# Altium schematic sheet charging_booster.SchDoc
size A2
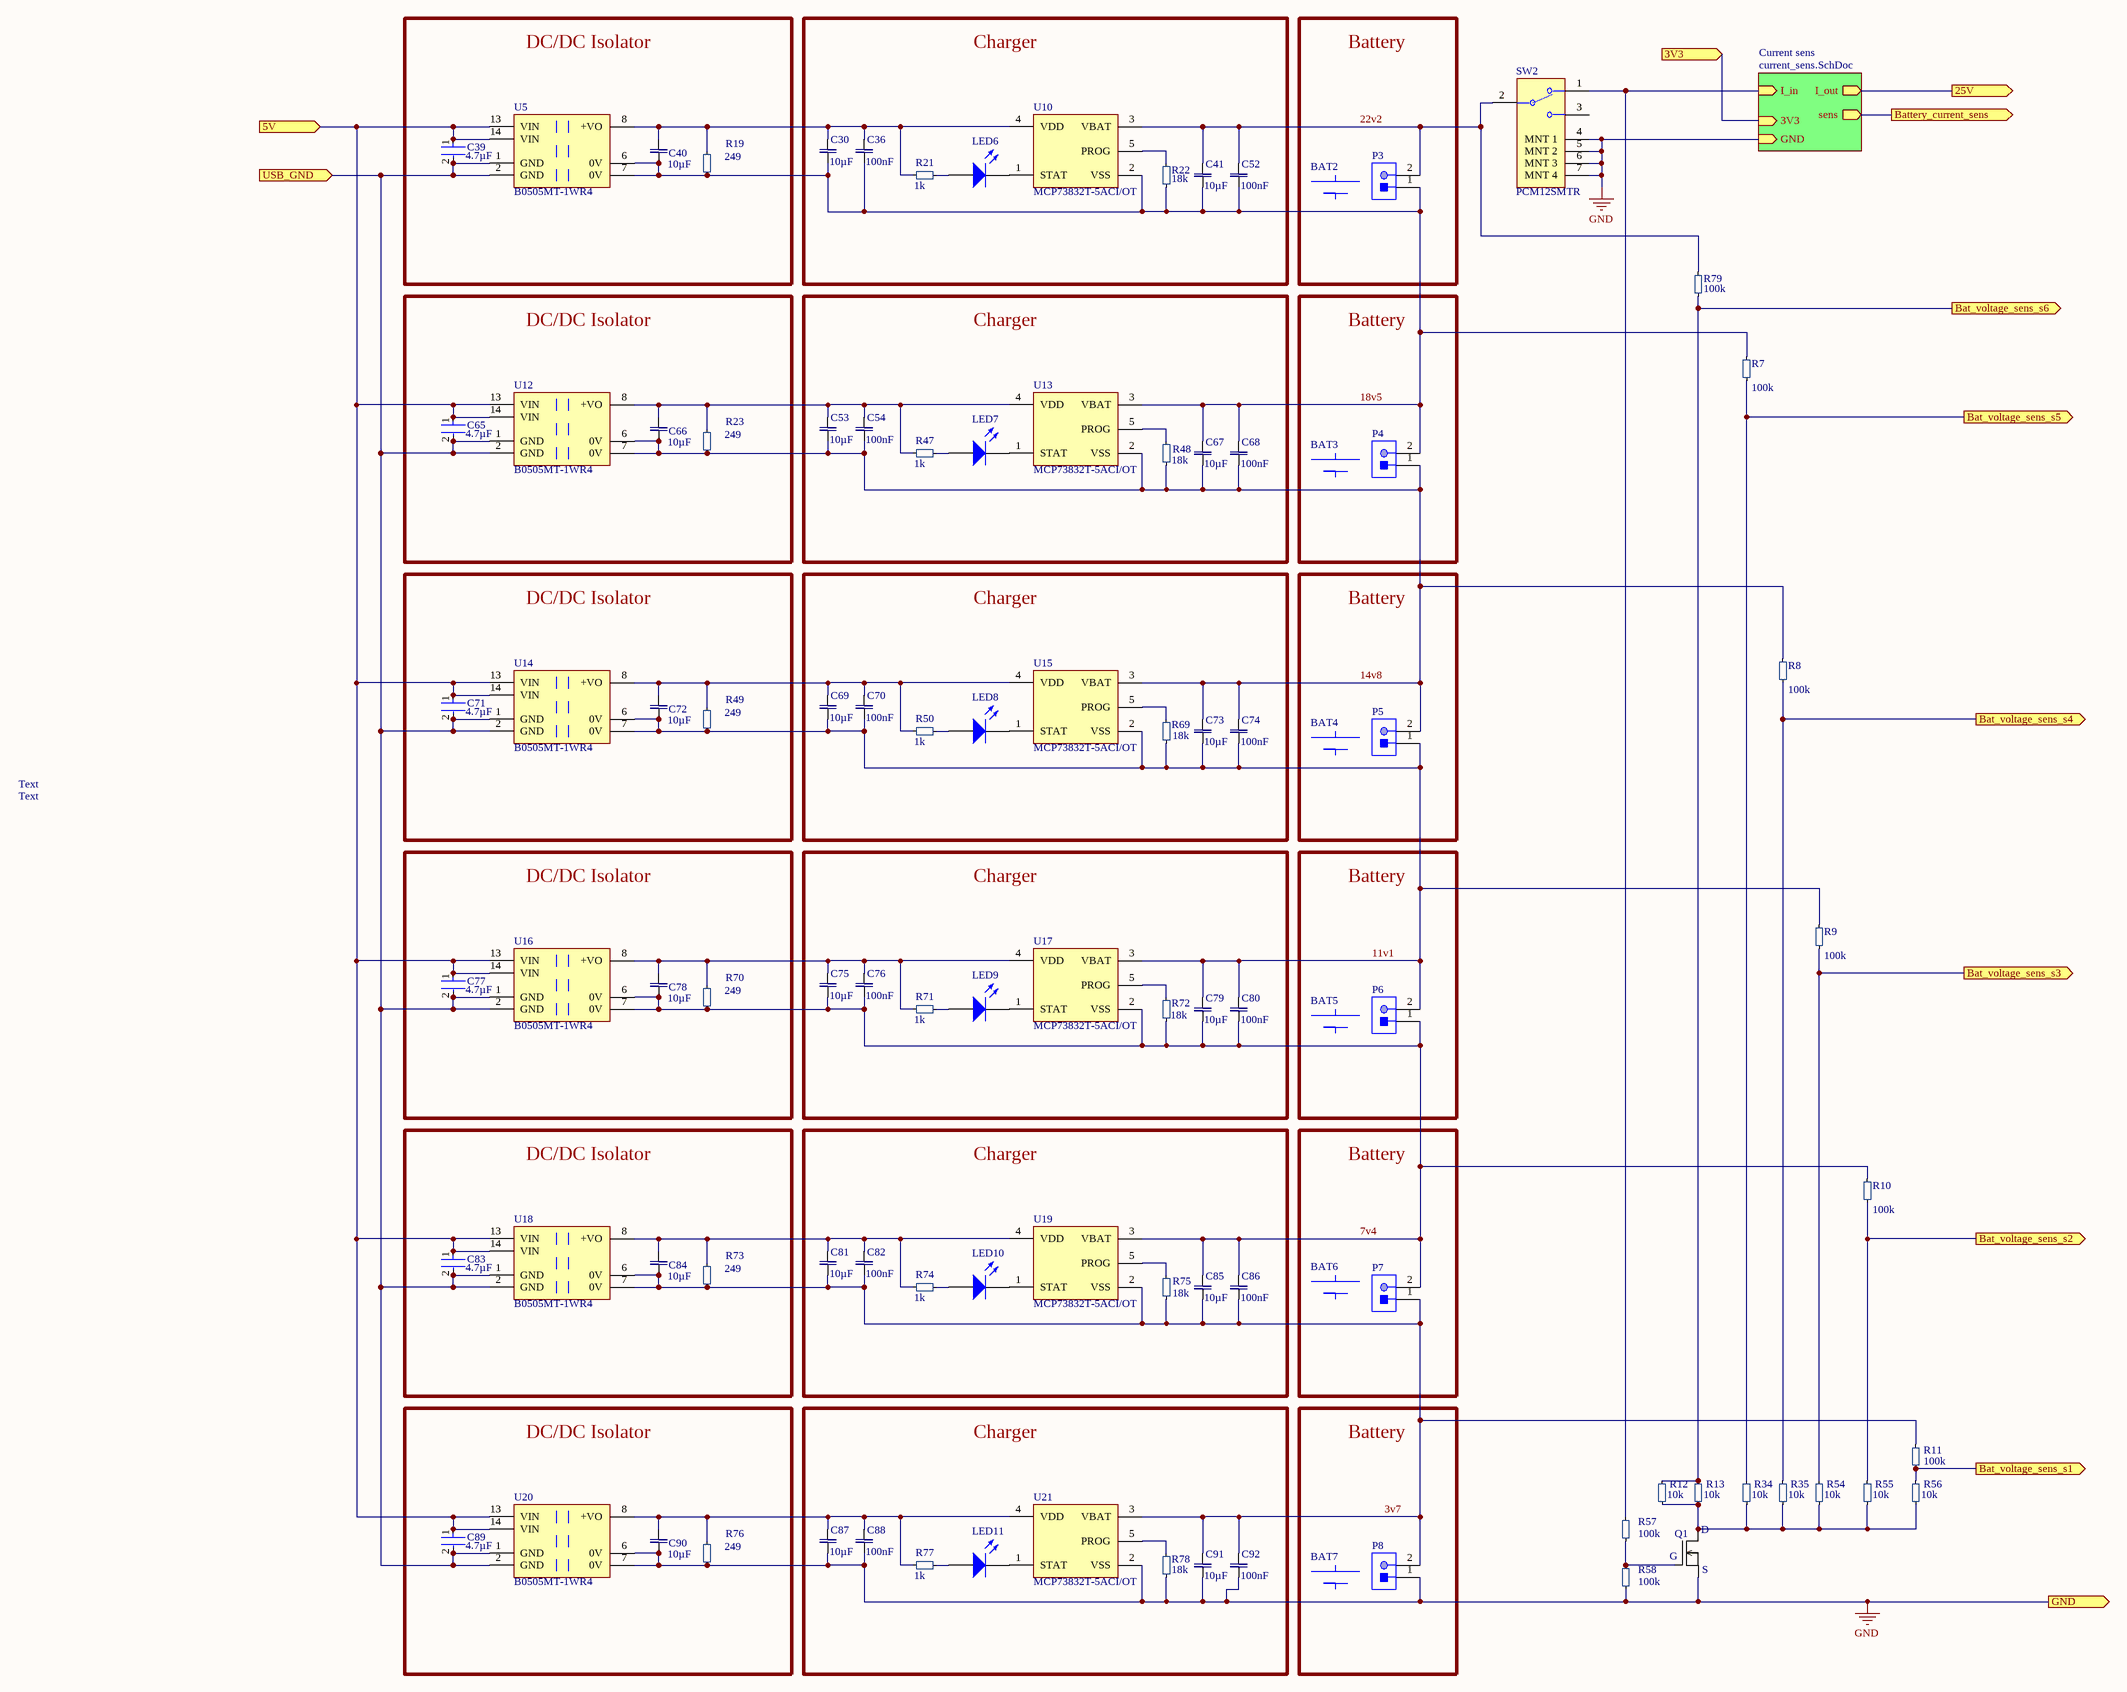
[diagram p0: charging_booster.SchDoc]

## Parts
BAT2  702035_380mAH_20C_ebay  (value not drawn)  (mechanical)
BAT3  702035_380mAH_20C_ebay  (value not drawn)  (mechanical)
BAT4  702035_380mAH_20C_ebay  (value not drawn)  (mechanical)
BAT5  702035_380mAH_20C_ebay  (value not drawn)  (mechanical)
BAT6  702035_380mAH_20C_ebay  (value not drawn)  (mechanical)
BAT7  702035_380mAH_20C_ebay  (value not drawn)  (mechanical)
C30  Capacitance: 10µF  [Chip2PinSM127P600-8N]  (hidden comment: CL31A106MBHNNNE)
C36  Capacitance: 100nF  [cap0402]  (hidden comment: GRM155R71H104ME14D)
C39  Capacitance: 4.7µF  [FP-CL21-IPC_A]  (hidden comment: CL21A475KAQNNNE)
C40  Capacitance: 10µF  [Chip2PinSM127P600-8N]  (hidden comment: CL31A106MBHNNNE)
C41  Capacitance: 10µF  [Chip2PinSM127P600-8N]  (hidden comment: CL31A106MBHNNNE)
C52  Capacitance: 100nF  [cap0402]  (hidden comment: GRM155R71H104ME14D)
C53  Capacitance: 10µF  [Chip2PinSM127P600-8N]  (hidden comment: CL31A106MBHNNNE)
C54  Capacitance: 100nF  [cap0402]  (hidden comment: GRM155R71H104ME14D)
C65  Capacitance: 4.7µF  [FP-CL21-IPC_A]  (hidden comment: CL21A475KAQNNNE)
C66  Capacitance: 10µF  [Chip2PinSM127P600-8N]  (hidden comment: CL31A106MBHNNNE)
C67  Capacitance: 10µF  [Chip2PinSM127P600-8N]  (hidden comment: CL31A106MBHNNNE)
C68  Capacitance: 100nF  [cap0402]  (hidden comment: GRM155R71H104ME14D)
C69  Capacitance: 10µF  [Chip2PinSM127P600-8N]  (hidden comment: CL31A106MBHNNNE)
C70  Capacitance: 100nF  [cap0402]  (hidden comment: GRM155R71H104ME14D)
C71  Capacitance: 4.7µF  [FP-CL21-IPC_A]  (hidden comment: CL21A475KAQNNNE)
C72  Capacitance: 10µF  [Chip2PinSM127P600-8N]  (hidden comment: CL31A106MBHNNNE)
C73  Capacitance: 10µF  [Chip2PinSM127P600-8N]  (hidden comment: CL31A106MBHNNNE)
C74  Capacitance: 100nF  [cap0402]  (hidden comment: GRM155R71H104ME14D)
C75  Capacitance: 10µF  [Chip2PinSM127P600-8N]  (hidden comment: CL31A106MBHNNNE)
C76  Capacitance: 100nF  [cap0402]  (hidden comment: GRM155R71H104ME14D)
C77  Capacitance: 4.7µF  [FP-CL21-IPC_A]  (hidden comment: CL21A475KAQNNNE)
C78  Capacitance: 10µF  [Chip2PinSM127P600-8N]  (hidden comment: CL31A106MBHNNNE)
C79  Capacitance: 10µF  [Chip2PinSM127P600-8N]  (hidden comment: CL31A106MBHNNNE)
C80  Capacitance: 100nF  [cap0402]  (hidden comment: GRM155R71H104ME14D)
C81  Capacitance: 10µF  [Chip2PinSM127P600-8N]  (hidden comment: CL31A106MBHNNNE)
C82  Capacitance: 100nF  [cap0402]  (hidden comment: GRM155R71H104ME14D)
C83  Capacitance: 4.7µF  [FP-CL21-IPC_A]  (hidden comment: CL21A475KAQNNNE)
C84  Capacitance: 10µF  [Chip2PinSM127P600-8N]  (hidden comment: CL31A106MBHNNNE)
C85  Capacitance: 10µF  [Chip2PinSM127P600-8N]  (hidden comment: CL31A106MBHNNNE)
C86  Capacitance: 100nF  [cap0402]  (hidden comment: GRM155R71H104ME14D)
C87  Capacitance: 10µF  [Chip2PinSM127P600-8N]  (hidden comment: CL31A106MBHNNNE)
C88  Capacitance: 100nF  [cap0402]  (hidden comment: GRM155R71H104ME14D)
C89  Capacitance: 4.7µF  [FP-CL21-IPC_A]  (hidden comment: CL21A475KAQNNNE)
C90  Capacitance: 10µF  [Chip2PinSM127P600-8N]  (hidden comment: CL31A106MBHNNNE)
C91  Capacitance: 10µF  [Chip2PinSM127P600-8N]  (hidden comment: CL31A106MBHNNNE)
C92  Capacitance: 100nF  [cap0402]  (hidden comment: GRM155R71H104ME14D)
LED6  150080BS75000  [0805_A]  (value not drawn)
LED7  150080BS75000  [0805_A]  (value not drawn)
LED8  150080BS75000  [0805_A]  (value not drawn)
LED9  150080BS75000  [0805_A]  (value not drawn)
LED10  150080BS75000  [0805_A]  (value not drawn)
LED11  150080BS75000  [0805_A]  (value not drawn)
P3  S2B-XH-A(LF)(SN)  [JST-S2B-XH-A(LF)(SN)_V]  (value not drawn)
P4  S2B-XH-A(LF)(SN)  [JST-S2B-XH-A(LF)(SN)_V]  (value not drawn)
P5  S2B-XH-A(LF)(SN)  [JST-S2B-XH-A(LF)(SN)_V]  (value not drawn)
P6  S2B-XH-A(LF)(SN)  [JST-S2B-XH-A(LF)(SN)_V]  (value not drawn)
P7  S2B-XH-A(LF)(SN)  [JST-S2B-XH-A(LF)(SN)_V]  (value not drawn)
P8  S2B-XH-A(LF)(SN)  [JST-S2B-XH-A(LF)(SN)_V]  (value not drawn)
Q1  SSM3K7002CFU,LF  [SSM3K7002CFU,LF-Footprint-1]  (value not drawn)
R7  Resistance: 100k  [SMD_0402(1005)_M]  (hidden comment: RC0402FR-07100KL)
R8  Resistance: 100k  [SMD_0402(1005)_M]  (hidden comment: RC0402FR-07100KL)
R9  Resistance: 100k  [SMD_0402(1005)_M]  (hidden comment: RC0402FR-07100KL)
R10  Resistance: 100k  [SMD_0402(1005)_M]  (hidden comment: RC0402FR-07100KL)
R11  Resistance: 100k  [SMD_0402(1005)_M]  (hidden comment: RC0402FR-07100KL)
R12  Resistance: 10k  [SMD_0402(1005)_M]  (hidden comment: RC0402FR-0710KL)
R13  Resistance: 10k  [SMD_0402(1005)_M]  (hidden comment: RC0402FR-0710KL)
R19  Resistance: 249  [SMD_0402(1005)_M]  (hidden comment: RC0402FR-07249RL)
R21  Resistance: 1k  [SMD_0402(1005)_M]  (hidden comment: RC0402FR-071KL)
R22  Resistance: 18k  [RESC1005X40X25NL05T10]  (hidden comment: RC0402FR0718K)
R23  Resistance: 249  [SMD_0402(1005)_M]  (hidden comment: RC0402FR-07249RL)
R34  Resistance: 10k  [SMD_0402(1005)_M]  (hidden comment: RC0402FR-0710KL)
R35  Resistance: 10k  [SMD_0402(1005)_M]  (hidden comment: RC0402FR-0710KL)
R47  Resistance: 1k  [SMD_0402(1005)_M]  (hidden comment: RC0402FR-071KL)
R48  Resistance: 18k  [RESC1005X40X25NL05T10]  (hidden comment: RC0402FR0718K)
R49  Resistance: 249  [SMD_0402(1005)_M]  (hidden comment: RC0402FR-07249RL)
R50  Resistance: 1k  [SMD_0402(1005)_M]  (hidden comment: RC0402FR-071KL)
R54  Resistance: 10k  [SMD_0402(1005)_M]  (hidden comment: RC0402FR-0710KL)
R55  Resistance: 10k  [SMD_0402(1005)_M]  (hidden comment: RC0402FR-0710KL)
R56  Resistance: 10k  [SMD_0402(1005)_M]  (hidden comment: RC0402FR-0710KL)
R57  Resistance: 100k  [SMD_0402(1005)_M]  (hidden comment: RC0402FR-07100KL)
R58  Resistance: 100k  [SMD_0402(1005)_M]  (hidden comment: RC0402FR-07100KL)
R69  Resistance: 18k  [RESC1005X40X25NL05T10]  (hidden comment: RC0402FR0718K)
R70  Resistance: 249  [SMD_0402(1005)_M]  (hidden comment: RC0402FR-07249RL)
R71  Resistance: 1k  [SMD_0402(1005)_M]  (hidden comment: RC0402FR-071KL)
R72  Resistance: 18k  [RESC1005X40X25NL05T10]  (hidden comment: RC0402FR0718K)
R73  Resistance: 249  [SMD_0402(1005)_M]  (hidden comment: RC0402FR-07249RL)
R74  Resistance: 1k  [SMD_0402(1005)_M]  (hidden comment: RC0402FR-071KL)
R75  Resistance: 18k  [RESC1005X40X25NL05T10]  (hidden comment: RC0402FR0718K)
R76  Resistance: 249  [SMD_0402(1005)_M]  (hidden comment: RC0402FR-07249RL)
R77  Resistance: 1k  [SMD_0402(1005)_M]  (hidden comment: RC0402FR-071KL)
R78  Resistance: 18k  [RESC1005X40X25NL05T10]  (hidden comment: RC0402FR0718K)
R79  Resistance: 100k  [SMD_0402(1005)_M]  (hidden comment: RC0402FR-07100KL)
SW2  PCM12SMTR  [FP-PCM12SMTR-MFG]
U5  B0505MT-1WR4  [FP-B0505MT-1WR4-MFG]
U10  MCP73832T-5ACI/OT  [SOT-23-OT5_M]
U12  B0505MT-1WR4  [FP-B0505MT-1WR4-MFG]
U13  MCP73832T-5ACI/OT  [SOT-23-OT5_M]
U14  B0505MT-1WR4  [FP-B0505MT-1WR4-MFG]
U15  MCP73832T-5ACI/OT  [SOT-23-OT5_M]
U16  B0505MT-1WR4  [FP-B0505MT-1WR4-MFG]
U17  MCP73832T-5ACI/OT  [SOT-23-OT5_M]
U18  B0505MT-1WR4  [FP-B0505MT-1WR4-MFG]
U19  MCP73832T-5ACI/OT  [SOT-23-OT5_M]
U20  B0505MT-1WR4  [FP-B0505MT-1WR4-MFG]
U21  MCP73832T-5ACI/OT  [SOT-23-OT5_M]

## Blocks framed on the sheet
DC/DC Isolator: C39 C40 R19 U5
Charger: C30 C36 C41 C52 LED6 R21 R22 U10
Battery: BAT2 P3
DC/DC Isolator: C65 C66 R23 U12
Charger: C53 C54 C67 C68 LED7 R47 R48 U13
Battery: BAT3 P4
DC/DC Isolator: C71 C72 R49 U14
Charger: C69 C70 C73 C74 LED8 R50 R69 U15
Battery: BAT4 P5
DC/DC Isolator: C77 C78 R70 U16
Charger: C75 C76 C79 C80 LED9 R71 R72 U17
Battery: BAT5 P6
DC/DC Isolator: C83 C84 R73 U18
Charger: C81 C82 C85 C86 LED10 R74 R75 U19
Battery: BAT6 P7
DC/DC Isolator: C89 C90 R76 U20
Charger: C87 C88 C91 C92 LED11 R77 R78 U21
Battery: BAT7 P8

## Sub-sheets
Current sens = current_sens.SchDoc: sens (out), I_in (in), I_out (out), GND (in), 3V3 (in)

## Ports
3V3 (in), 5V (in), 25V (out), Bat_voltage_sens_s1 (out), Bat_voltage_sens_s2 (out), Bat_voltage_sens_s3 (out), Bat_voltage_sens_s4 (out), Bat_voltage_sens_s5 (out), Bat_voltage_sens_s6 (out), Battery_current_sens (out), GND (out), USB_GND (in)

## Nets
GND: C87.1 C88.1 C90.1 C91.1 C92.1 P8.1 Q1.2(D) R58.1 R76.1 R78.1 SW2.4(MNT_1) SW2.5(MNT_2) SW2.6(MNT_3) SW2.7(MNT_4) U20.6(0V) U20.7(0V) U21.2(VSS) ; port GND, sheet Current sens/GND
3V3: port 3V3, sheet Current sens/3V3
3v7: C81.1 C82.1 C84.1 C85.1 C86.1 C91.2 C92.2 P7.1 P8.2 R11.2 R73.1 R75.1 U18.6(0V) U18.7(0V) U19.2(VSS) U21.3(VBAT)
5V: C39.1 C65.1 C71.1 C77.1 C83.1 C89.1 U5.13(VIN) U5.14(VIN) U12.13(VIN) U12.14(VIN) U14.13(VIN) U14.14(VIN) U16.13(VIN) U16.14(VIN) U18.13(VIN) U18.14(VIN) U20.13(VIN) U20.14(VIN) ; port 5V
7v4: C75.1 C76.1 C78.1 C79.1 C80.1 C85.2 C86.2 P6.1 P7.2 R10.2 R70.1 R72.1 U16.6(0V) U16.7(0V) U17.2(VSS) U19.3(VBAT)
11v1: C69.1 C70.1 C72.1 C73.1 C74.1 C79.2 C80.2 P5.1 P6.2 R9.2 R49.1 R69.1 U14.6(0V) U14.7(0V) U15.2(VSS) U17.3(VBAT)
14v8: C53.1 C54.1 C66.1 C67.1 C68.1 C73.2 C74.2 P4.1 P5.2 R8.2 R23.1 R48.1 U12.6(0V) U12.7(0V) U13.2(VSS) U15.3(VBAT)
18v5: C30.1 C36.1 C40.1 C41.1 C52.1 C67.2 C68.2 P3.1 P4.2 R7.2 R19.1 R22.1 U5.6(0V) U5.7(0V) U10.2(VSS) U13.3(VBAT)
22v2: C41.2 C52.2 P3.2 R79.2 SW2.2 U10.3(VBAT)
25V: port 25V, sheet Current sens/I_out
Bat_voltage_sens_s1: R11.1 R56.2 ; port Bat_voltage_sens_s1
Bat_voltage_sens_s2: R10.1 R55.2 ; port Bat_voltage_sens_s2
Bat_voltage_sens_s3: R9.1 R54.2 ; port Bat_voltage_sens_s3
Bat_voltage_sens_s4: R8.1 R35.2 ; port Bat_voltage_sens_s4
Bat_voltage_sens_s5: R7.1 R34.2 ; port Bat_voltage_sens_s5
Bat_voltage_sens_s6: R12.2 R13.2 R79.1 ; port Bat_voltage_sens_s6
Battery_current_sens: port Battery_current_sens, sheet Current sens/sens
USB_GND: C39.2 C65.2 C71.2 C77.2 C83.2 C89.2 U5.1(GND) U5.2(GND) U12.1(GND) U12.2(GND) U14.1(GND) U14.2(GND) U16.1(GND) U16.2(GND) U18.1(GND) U18.2(GND) U20.1(GND) U20.2(GND) ; port USB_GND
NetC30_2: C30.2 C36.2 C40.2 R19.2 R21.2 U5.8(+VO) U10.4(VDD)
NetC53_2: C53.2 C54.2 C66.2 R23.2 R47.2 U12.8(+VO) U13.4(VDD)
NetC69_2: C69.2 C70.2 C72.2 R49.2 R50.2 U14.8(+VO) U15.4(VDD)
NetC75_2: C75.2 C76.2 C78.2 R70.2 R71.2 U16.8(+VO) U17.4(VDD)
NetC81_2: C81.2 C82.2 C84.2 R73.2 R74.2 U18.8(+VO) U19.4(VDD)
NetC87_2: C87.2 C88.2 C90.2 R76.2 R77.2 U20.8(+VO) U21.4(VDD)
NetLED6_1: LED6.1(K) U10.1(STAT)
NetLED6_2: LED6.2(A) R21.1
NetLED7_1: LED7.1(K) U13.1(STAT)
NetLED7_2: LED7.2(A) R47.1
NetLED8_1: LED8.1(K) U15.1(STAT)
NetLED8_2: LED8.2(A) R50.1
NetLED9_1: LED9.1(K) U17.1(STAT)
NetLED9_2: LED9.2(A) R71.1
NetLED10_1: LED10.1(K) U19.1(STAT)
NetLED10_2: LED10.2(A) R74.1
NetLED11_1: LED11.1(K) U21.1(STAT)
NetLED11_2: LED11.2(A) R77.1
NetQ1_1: Q1.1(G) R57.1 R58.2
NetQ1_3: Q1.3(S) R12.1 R13.1 R34.1 R35.1 R54.1 R55.1 R56.1
NetR22_2: R22.2 U10.5(PROG)
NetR48_2: R48.2 U13.5(PROG)
NetR57_2: R57.2 SW2.1 ; sheet Current sens/I_in
NetR69_2: R69.2 U15.5(PROG)
NetR72_2: R72.2 U17.5(PROG)
NetR75_2: R75.2 U19.5(PROG)
NetR78_2: R78.2 U21.5(PROG)

Not connected (* = marked no-connect by the designer): SW2 3

## Notes on the sheet
- Text

## Library data of the parts
BAT2-BAT7 = CMP-ROOT-0003-1: https://www.ebay.com/itm/122071978357; Voltage: 3.7V; Capacity: 380mAh; Mount: connector; RoHS: Yes; ComponentLink1URL: https://www.ebay.com/itm/122071978357?hash=item1c6c0e9175:g:xIQAAOSwTuJYpQfy; ComponentLink1Description: EBAY; Type: li-po; Case/Package: 702035
C30 C40 C41 C53 C66 C67 C69 C72 C73 C75 C78 C79 C81 C84 C85 C87 C90 C91 = CMP-0001-00015-3: CAP CER 10UF 50V X5R 1206; Capacitor Type: Ceramic; Tolerance: 20%; Thickness: 0.071inch; Mount: Surface Mount; Dielectric: X5R; Length: 0.126inch; Case/Package: 1206; Width: 0.063inch; Voltage Rating (DC): 50V; Max Operating Temperature: 85°C; Case Code (Imperial): 1206; Voltage Rating: 50V; Min Operating Temperature: -55°C; Packaging: Tape and Reel; Case Code (Metric): 3216; RoHS: Yes
C36 C52 C54 C68 C70 C74 C76 C80 C82 C86 C88 C92 = CMP-0001-00001-9: 0402 0.1 uF 50 V ±20% Tolerance X7R SMT Monolithic Ceramic Chip Capacitor; Value: 100nF; Voltage Rating: 50V; Length: 0.039inch; Packaging: Cut Tape; Max Operating Temperature: 125°C; Min Operating Temperature: -55°C; Mount: Surface Mount; Case/Package: 0402; Tolerance: 20%; Width: 0.02inch; Capacitor Type: Ceramic; Thickness: 0.022inch; Pins: 2; RoHS: Yes
C39 C65 C71 C77 C83 C89 = CMP-0001-00018-1: SAMSUNG ELECTRO-MECHANICS - CL21A475KAQNNNE - SMD Multilayer Ceramic Capacitor, 4.7 µF, 25 V, 0805 [2012 Metric], ± 10%, X5R, CL Series; Voltage Rating: 25V; Case/Package: 0805; Dielectric: X5R; Package Quantity: 1; Width: 0.049inch; Length: 2mm; Tolerance: 10%; Capacitor Type: Ceramic; Depth: 1.25mm; Case Code (Imperial): 0805; RoHS: Yes; Height: 1.25mm; Mount: Surface Mount; Thickness: 0.055inch; Packaging: Tape and Reel; Max Operating Temperature: 85°C; Case Code (Metric): 2012; Lead Free: Lead Free; Min Operating Temperature: -55°C; Voltage Rating (DC): 25V; Radiation Hardening: No
LED6-LED11 = CMP-00002-1: SMD LED blue 3.5 V 0805, 150080BS75000, Würth Elektronik; Dominant Wavelength: 470nm; Luminous Intensity: 145mcd; Lens Style: Clear,Rectangular; Forward Current: 30mA; Test Current: 20mA; Forward Voltage: 3.2V; Viewing Angle: 140°; Length: 2mm; Width: 1.25mm; RoHS: Yes; Height: 0.7mm; Color: Blue; Packaging: Tape and Reel; REACH SVHC: Unknown; Max Operating Temperature: 85°C; Case Code (Imperial): 0805; Lead Free: Lead Free; Case Code (Metric): 2012; Case/Package: 0805; Min Operating Temperature: -40°C; Wavelength: 470nm; Package Quantity: 4000; Mount: Surface Mount
P3-P8 = CMP-ROOT-00028-1: XH Series 2.5mm 2 Position Through Hole Shrouded Header Connector; Number of Positions: 2; RoHS: Yes; System: Connector; Mount: Through Hole
Q1 = CMP-ROOT-00035-2: Trans MOSFET N-CH Si 60V 0.17A 3-Pin USM T/R; Max Power Dissipation: 150mW; Continuous Drain Current (ID): 170mA; Input Capacitance: 17pF; Rds On Max: 3.0ohm; Case/Package: SMD/SMT; Drain to Source Voltage (Vdss): 60V; RoHS: Yes; Max Operating Temperature: 150°C; Mount: Surface Mount; Min Operating Temperature: -55°C; Packaging: Tape and Reel
R7-R11 R57 R58 R79 = CMP-0001-00006-5: Res General Purpose Thick Film 0402 100K Ohm 1% 1/16W ±100ppm/°C Molded SMD Paper T/R; Max Power Dissipation: 63mW; Voltage Rating: 50V; Value: 100k; Termination: SMD/SMT; Tolerance: 1%; Length: 0.039inch; REACH SVHC: No SVHC; Features: Moisture Resistant; Mount: SMD; Power Rating: 63mW; Depth: 0.5mm; Max Operating Temperature: 155°C; Width: 0.02inch; Height: 0.016inch; Case Code (Metric): 1005; Temperature Coefficient: 100ppm/°C; Military Standard: Not; Case/Package: 0402; Lead Free: Lead Free; Working Voltage: 50V; Package Quantity: 1; Number of Terminations: 2; Min Operating Temperature: -55°C; Composition: Thick Film; RoHS: Yes; Packaging: Tape and Reel; Case Code (Imperial): 0402
R12 R13 R34 R35 R54-R56 = CMP-008-0005-10: Surface Mount Thick Film Resistor, Rc Series, 10 Kohm, 62.5 Mw, - 1%, 50 V, 0402 [1005 Metric]; Voltage Rating: 50V; Power Rating: 62.5mW; Value: 10k; Temperature Coefficient: 100ppm/°C; Case/Package: 0402; Lead Pitch: 0.2mm; Tolerance: 1%; Composition: Thick Film; Voltage Rating (DC): 50V; Case Code (Metric): 1005; Width: 0.5mm; Lead Free: Lead Free; Number of Terminations: 2; Number of Pins: 2; Mount: SMD; Termination: SMD/SMT; Military Standard: Not; REACH SVHC: No SVHC; Length: 1mm; Depth: 0.5mm; Working Voltage: 50V; Packaging: Tape and Reel; Case Code (Imperial): 0402; Max Operating Temperature: 155°C; Height: 0.32mm; RoHS: Yes; Min Operating Temperature: -55°C
R19 R23 R49 R70 R73 R76 = CMP-0001-00022-3: Res Thick Film 0402 249 Ohm 1% 1/16W ±100ppm/°C Molded SMD Paper T/R; Capacitor Type: Ceramic; Mount: SMD; Case/Package: 0402; RoHS: Yes; Tolerance: 1%
R21 R47 R50 R71 R74 R77 = CMP-001-0000-8: Surface Mount Chip Resistor, Thick Film, RC Series, 1 kohm, 62.5 mW, 1%, 50 V, 0402 [1005 Metric]; Temperature Coefficient: 100ppm/°C; Value: 1k; Voltage Rating: 50V; Power Rating: 62.5mW; RoHS: Yes; Max Operating Temperature: 155°C; Width: 0.5mm; Case Code (Metric): 1005; Mount: SMD; Min Operating Temperature: -55°C; Lead Free: Lead Free; Military Standard: Not; Case Code (Imperial): 0402; Number of Pins: 2; Height: 0.32mm; Case/Package: 0402; Composition: Thick Film; Packaging: Tape and Reel; Length: 1mm; Tolerance: 1%; Depth: 0.5mm; Voltage Rating (DC): 50V; Termination: SMD/SMT; REACH SVHC: Unknown
R22 R48 R69 R72 R75 R78 = CMP-001-0023-4: RES SMD 18K OHM 1% 1/16W 0402; Temperature Coefficient: 100ppm/°C; Voltage Rating: 50V; Power Rating: 62.5mW; RoHS: Yes; Max Operating Temperature: 155°C; Width: 0.02inch; Case Code (Metric): 1005; Mount: SMD; Min Operating Temperature: -55°C; Lead Free: Lead Free; Military Standard: Not; Value: 18k; Height: 0.016inch; Case/Package: 0402; Composition: Thick Film; Packaging: Tape and Reel; Length: 1mm; Tolerance: 1%; Depth: 0.5mm; Termination: SMD/SMT; REACH SVHC: Unknown; Weight: 2.3E-05oz
SW2 = CMP-ROOT-00026-3: C & K COMPONENTS - PCM12SMTR - SWITCH, SPDT, 0.3A, 6VDC, SMD; Contact Current Rating: 300mA; Switch Function: On-On; Voltage Rating (DC): 6V; Actuator Type: Standard; Insulation Resistance: 100mR; Contact Resistance: 70mR; Switch Travel: 1.5mm; Actuator Material: Nylon,Polyamide,PA46; Mechanical Life: 10000Cycles; Lead Free: Lead Free; Throw Configuration: SPDT; Width: 6.7mm; Package Quantity: 1; Case/Package: smd; REACH SVHC: No SVHC; Series: PCM; Termination: Gull Wing; Contact Material: Copper Alloy,Copper,Silver; Min Operating Temperature: -20°C; Length: 7.7mm; Max Current Rating: 300mA; Orientation: Right Angle; Current Rating: 300mA; Voltage Rating (AC): 6V; Max Operating Temperature: 85°C; Mount: Surface Mount; Depth: 5mm; Packaging: Tape and Reel; Max Voltage Rating (DC): 6V; Actuator Length: 1.5mm; Contact Plating: Silver; RoHS: Yes
U5 U12 U14 U16 U18 U20 = CMP-ROOT-00029-1: DC DC Converter 5V 1W; Case/Package: 14-SMD Module, 7 Leads; Mount: SMD; RoHS: Yes
U10 U13 U15 U17 U19 U21 = CMP-006-0004-3: BATTERY CHARGER, 500mA, SOT23-5; Battery Type:Li-Ion, Li-Pol; Input Voltage:6V; Battery Charge Voltage:4.2V; Charge Current Max:500mA; Battery IC Case Style:SOT-23; No. of Pins:5; No. of Series Cells:1; Operating Temperature Max:85 C; Max Supply Voltage: 6V; Number of Cells: 1; Max Output Voltage: 4.5V; Max Power Dissipation: 1.54W; Min Supply Voltage: 3.75V; Min Output Voltage: 4.168V; Width: 1.8mm; Case/Package: SOT-23; Height: 1.3mm; Radiation Hardening: No; Max Charge Current: 500mA; Min Operating Temperature: -40°C; Max Input Voltage: 6V; Contact Plating: Tin,Matte; Length: 3.1mm; Package Quantity: 3000; Termination: SMD/SMT; Number of Outputs: 1; Max Output Current: 500mA; Mount: Surface Mount; Output Current: 500mA; Number of Channels: 1; Output Voltage: 4.5V; Max Operating Temperature: 85°C; REACH SVHC: No SVHC; Packaging: Tape and Reel; Number of Pins: 5; Power Dissipation: 1.54W; Lead Free: Lead Free